# EAGLE schematic Works_007 (EAGLE 8.2.1)
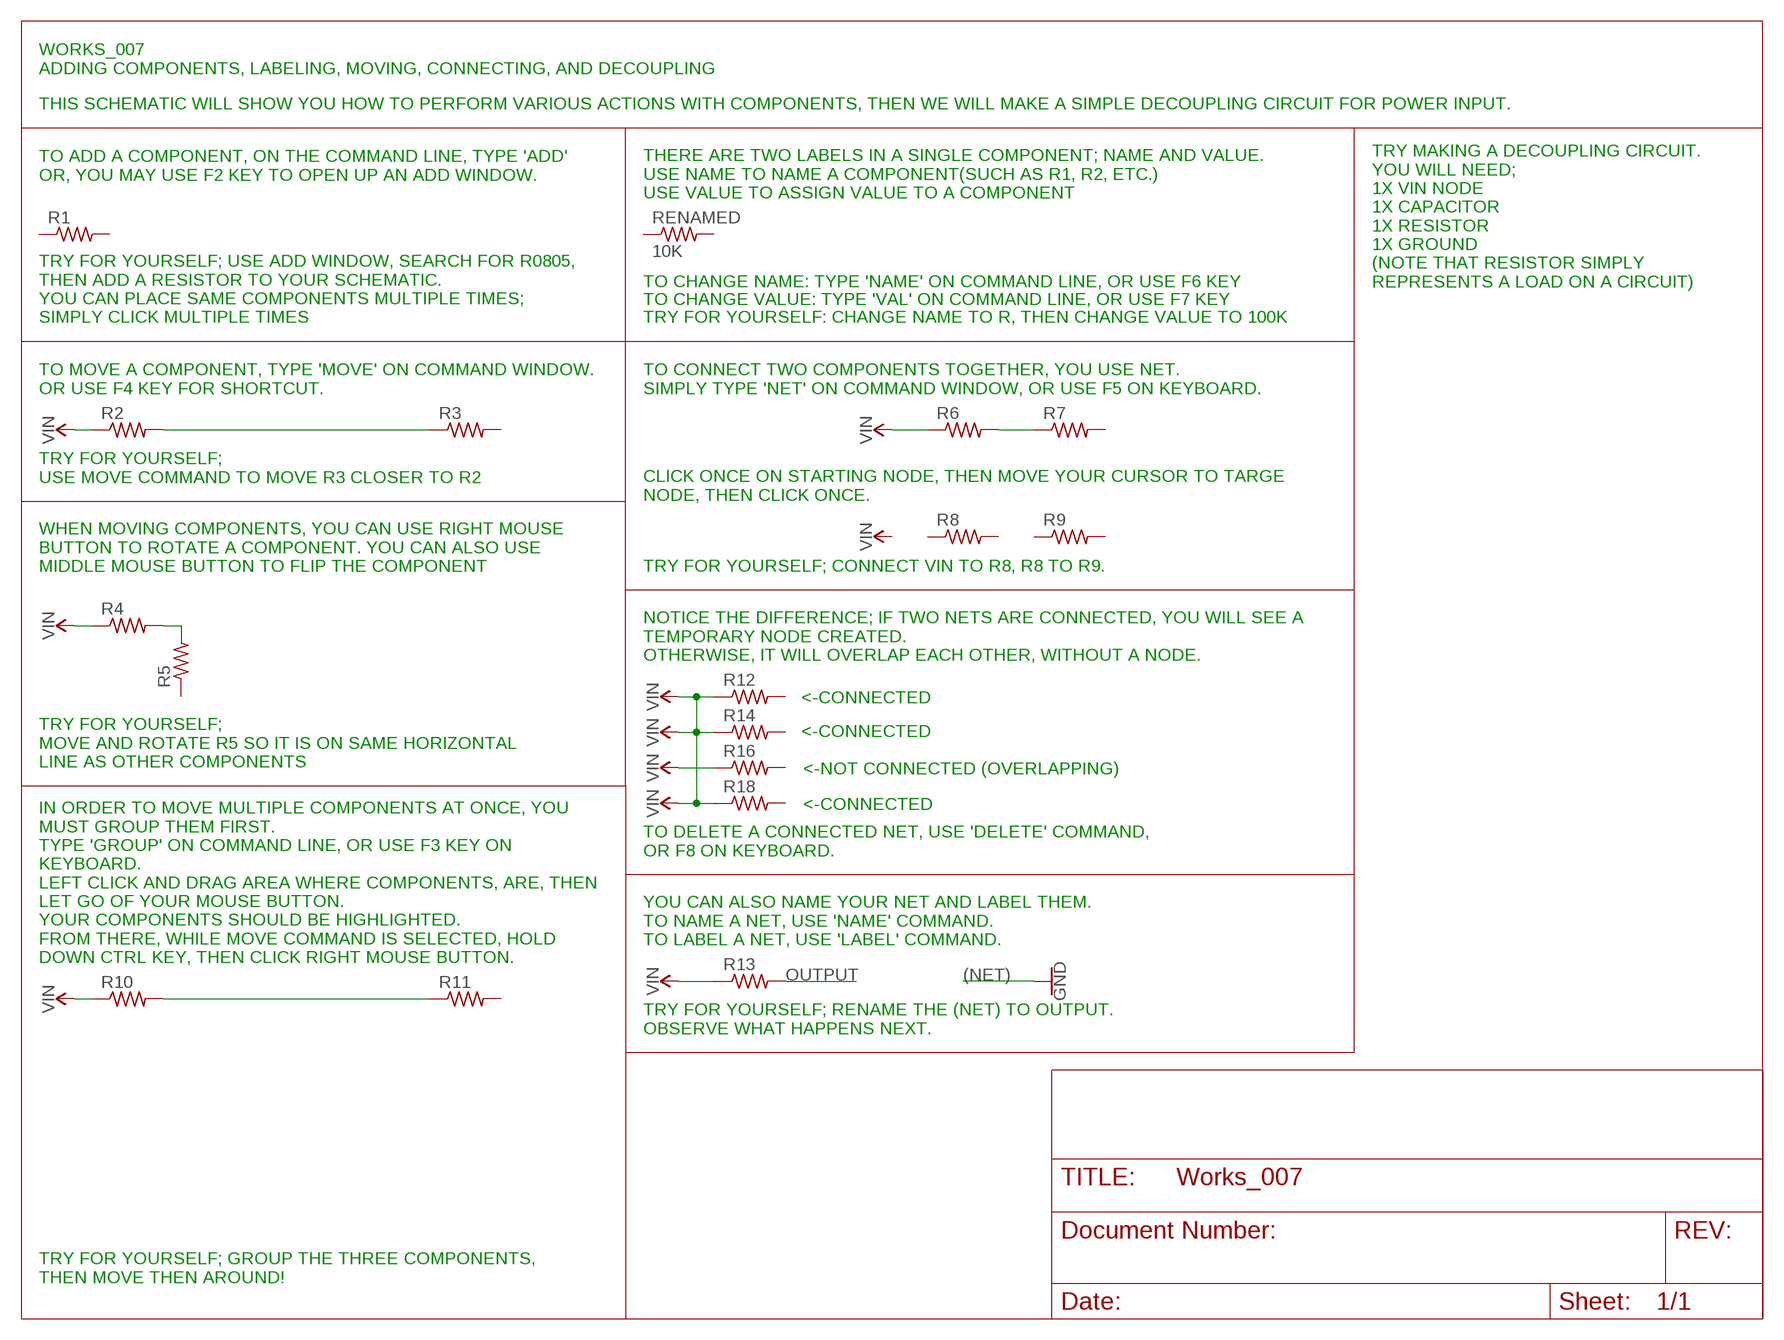
[diagram p0: schematic, sheet 1]

## Parts
R1  R-US_R0805  [R0805]
R2  R-US_R0805  [R0805]
R3  R-US_R0805  [R0805]
R4  R-US_R0805  [R0805]
R5  R-US_R0805  [R0805]
R6  R-US_R0805  [R0805]
R7  R-US_R0805  [R0805]
R8  R-US_R0805  [R0805]
R9  R-US_R0805  [R0805]
R10  R-US_R0805  [R0805]
R11  R-US_R0805  [R0805]
R12  R-US_R0805  [R0805]
R13  R-US_R0805  [R0805]
R14  R-US_R0805  [R0805]
R16  R-US_R0805  [R0805]
R18  R-US_R0805  [R0805]
RENAMED  10K  R-US_R0805  [R0805]

## Nets
N$1: R2.2 R3.1
N$2: R4.2 R5.2
N$3: R6.2 R7.1
N$4: R10.2 R11.1
OUTPUT: R13.2
VIN: R2.1 R4.1 R6.1 R10.1 R12.1 R13.1 R14.1 R16.1 R18.1
Unconnected: R1.1 R1.2 R3.2 R5.1 R7.2 R8.1 R8.2 R9.1 R9.2 R11.2 R12.2 R14.2 R16.2 R18.2 RENAMED.1 RENAMED.2

## Notes on the sheet
- WORKS_007
  ADDING COMPONENTS, LABELING, MOVING, CONNECTING, AND DECOUPLING
- THIS SCHEMATIC WILL SHOW YOU HOW TO PERFORM VARIOUS ACTIONS WITH COMPONENTS, THEN WE WILL MAKE A SIMPLE DECOUPLING CIRCUIT FOR POWER INPUT.
- TO ADD A COMPONENT, ON THE COMMAND LINE, TYPE 'ADD'
  OR, YOU MAY USE F2 KEY TO OPEN UP AN ADD WINDOW.
- THERE ARE TWO LABELS IN A SINGLE COMPONENT; NAME AND VALUE.
  USE NAME TO NAME A COMPONENT(SUCH AS R1, R2, ETC.)
  USE VALUE TO ASSIGN VALUE TO A COMPONENT
- TO CHANGE NAME: TYPE 'NAME' ON COMMAND LINE, OR USE F6 KEY
- TRY MAKING A DECOUPLING CIRCUIT.
  YOU WILL NEED;
  1X VIN NODE
  1X CAPACITOR
  1X RESISTOR
  1X GROUND
  (NOTE THAT RESISTOR SIMPLY
  REPRESENTS A LOAD ON A CIRCUIT)
- TO CHANGE VALUE: TYPE 'VAL' ON COMMAND LINE, OR USE F7 KEY
- TRY FOR YOURSELF; USE ADD WINDOW, SEARCH FOR R0805,
  THEN ADD A RESISTOR TO YOUR SCHEMATIC.
  YOU CAN PLACE SAME COMPONENTS MULTIPLE TIMES;
  SIMPLY CLICK MULTIPLE TIMES
- TRY FOR YOURSELF: CHANGE NAME TO R, THEN CHANGE VALUE TO 100K
- TO MOVE A COMPONENT, TYPE 'MOVE' ON COMMAND WINDOW.
  OR USE F4 KEY FOR SHORTCUT.
- TO CONNECT TWO COMPONENTS TOGETHER, YOU USE NET.
  SIMPLY TYPE 'NET' ON COMMAND WINDOW, OR USE F5 ON KEYBOARD.
- TRY FOR YOURSELF;
  USE MOVE COMMAND TO MOVE R3 CLOSER TO R2
- CLICK ONCE ON STARTING NODE, THEN MOVE YOUR CURSOR TO TARGE
  NODE, THEN CLICK ONCE.
- WHEN MOVING COMPONENTS, YOU CAN USE RIGHT MOUSE
  BUTTON TO ROTATE A COMPONENT. YOU CAN ALSO USE
  MIDDLE MOUSE BUTTON TO FLIP THE COMPONENT
- TRY FOR YOURSELF; CONNECT VIN TO R8, R8 TO R9.
- NOTICE THE DIFFERENCE; IF TWO NETS ARE CONNECTED, YOU WILL SEE A
  TEMPORARY NODE CREATED.
  OTHERWISE, IT WILL OVERLAP EACH OTHER, WITHOUT A NODE.
- <-CONNECTED
- <-CONNECTED
- TRY FOR YOURSELF;
  MOVE AND ROTATE R5 SO IT IS ON SAME HORIZONTAL
  LINE AS OTHER COMPONENTS
- <-NOT CONNECTED (OVERLAPPING)
- <-CONNECTED
- TO DELETE A CONNECTED NET, USE 'DELETE' COMMAND,
  OR F8 ON KEYBOARD.
- YOU CAN ALSO NAME YOUR NET AND LABEL THEM.
  TO NAME A NET, USE 'NAME' COMMAND.
  TO LABEL A NET, USE 'LABEL' COMMAND.
- IN ORDER TO MOVE MULTIPLE COMPONENTS AT ONCE, YOU
  MUST GROUP THEM FIRST.
  TYPE 'GROUP' ON COMMAND LINE, OR USE F3 KEY ON 
  KEYBOARD.
  LEFT CLICK AND DRAG AREA WHERE COMPONENTS, ARE, THEN
  LET GO OF YOUR MOUSE BUTTON.
  YOUR COMPONENTS SHOULD BE HIGHLIGHTED.
  FROM THERE, WHILE MOVE COMMAND IS SELECTED, HOLD
  DOWN CTRL KEY, THEN CLICK RIGHT MOUSE BUTTON.
- TRY FOR YOURSELF; RENAME THE (NET) TO OUTPUT.
  OBSERVE WHAT HAPPENS NEXT.
- TRY FOR YOURSELF; GROUP THE THREE COMPONENTS,
  THEN MOVE THEN AROUND!

## Library data of the parts
R1-R14 R16 R18 RENAMED = adafruit:R-US_: RESISTOR, American symbol